# EAGLE design LED-Board (EAGLE 7.2.0)
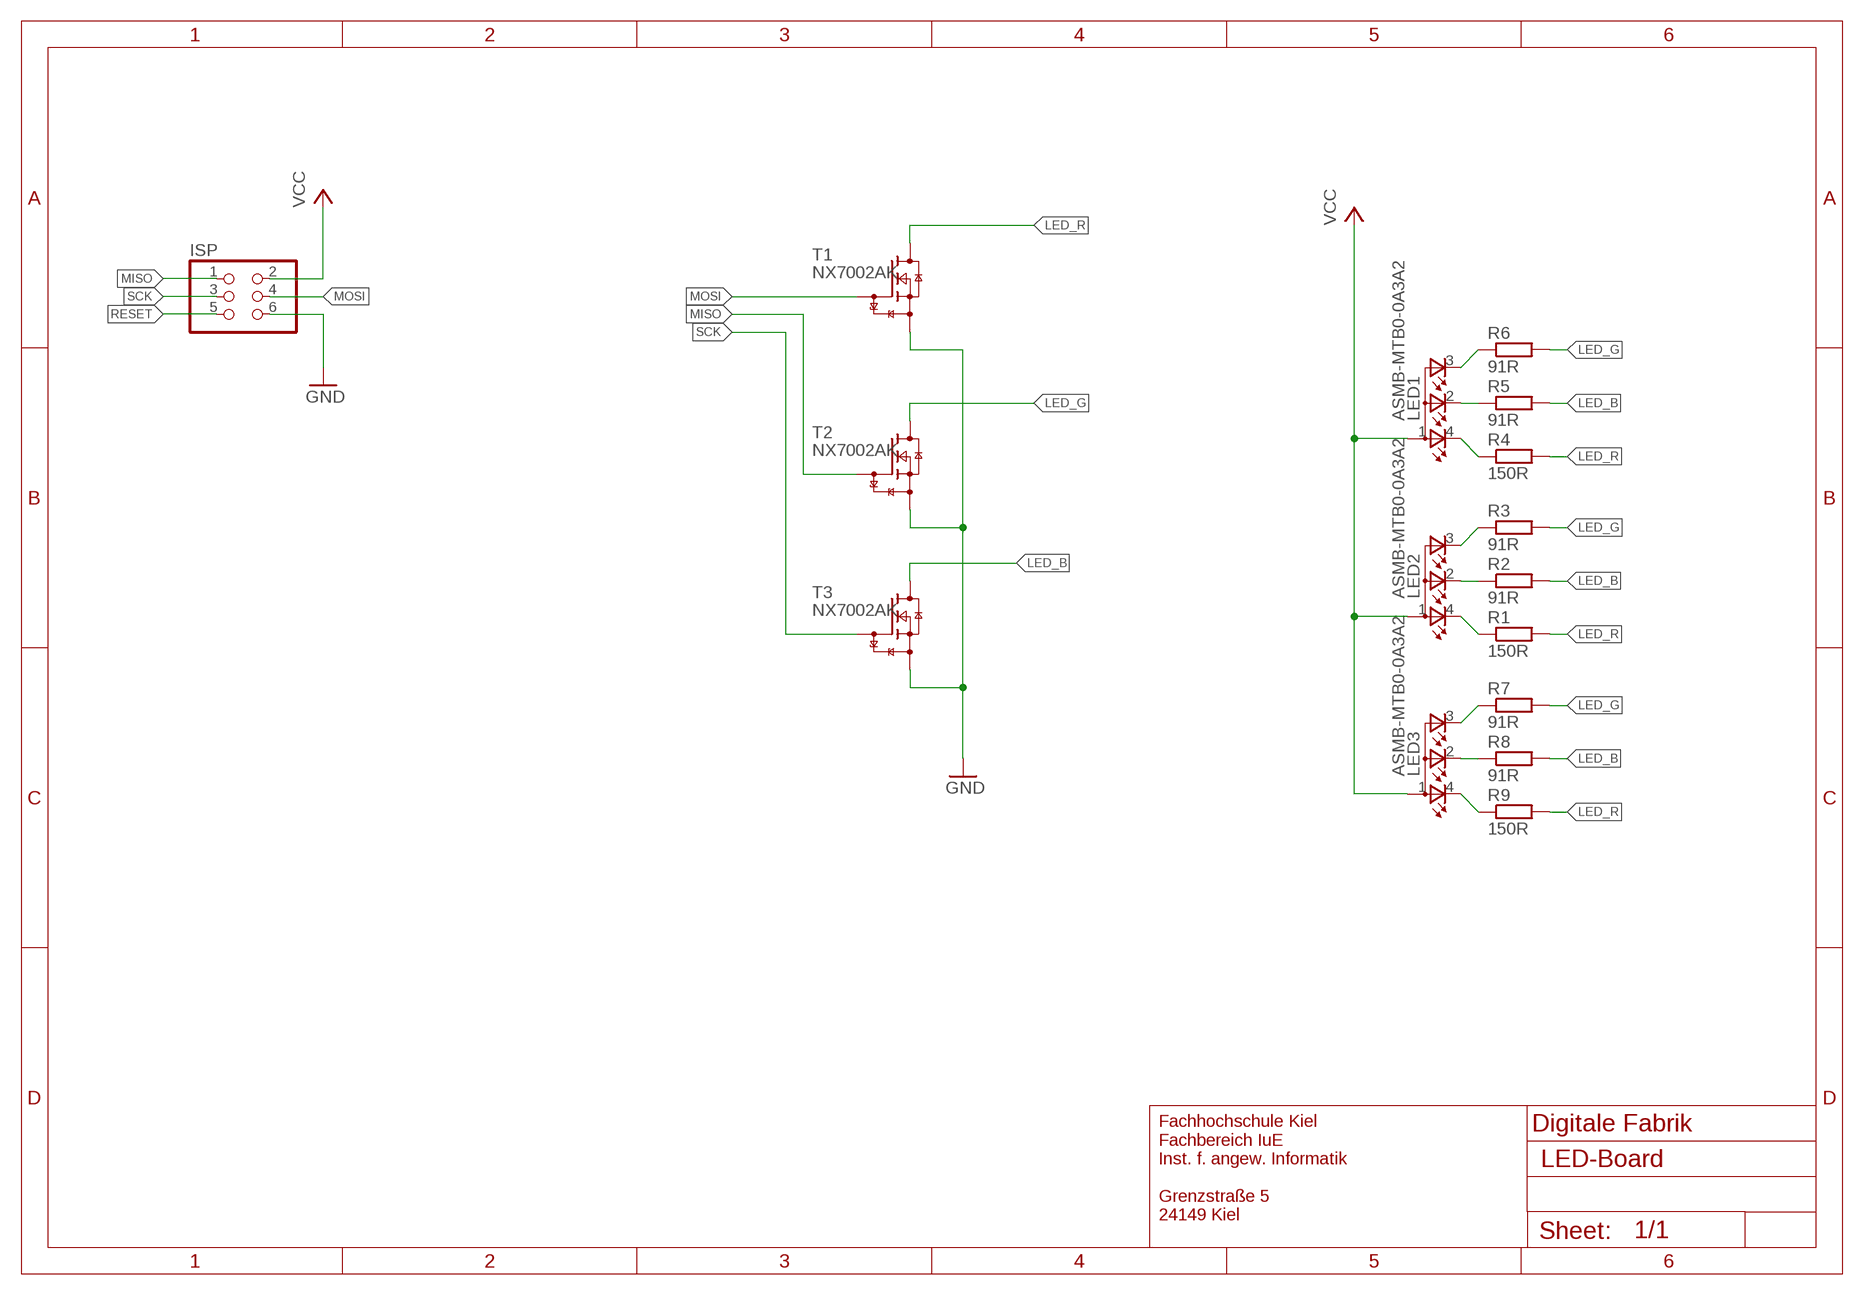
[diagram p0: schematic, sheet 1]

## Parts
ISP  PINHD-2X03_2.54-SMD  [2X03SMD]
LED1  ASMB-MTB0-0A3A2  PLCC4  [P-LCC-4-3]
LED2  ASMB-MTB0-0A3A2  PLCC4  [P-LCC-4-3]
LED3  ASMB-MTB0-0A3A2  PLCC4  [P-LCC-4-3]
R1  150R  R-EU_R0805  [R0805]
R2  91R  R-EU_R0805  [R0805]
R3  91R  R-EU_R0805  [R0805]
R4  150R  R-EU_R0805  [R0805]
R5  91R  R-EU_R0805  [R0805]
R6  91R  R-EU_R0805  [R0805]
R7  91R  R-EU_R0805  [R0805]
R8  91R  R-EU_R0805  [R0805]
R9  150R  R-EU_R0805  [R0805]
T1  NX7002AK  2N7002CK  [SOT23]
T2  NX7002AK  2N7002CK  [SOT23]
T3  NX7002AK  2N7002CK  [SOT23]

## Nets
GND: ISP.6 T1.2(S) T2.2(S) T3.2(S)
LED_B: R2.2 R5.2 R8.2 T3.3(D)
LED_G: R3.2 R6.2 R7.2 T2.3(D)
LED_R: R1.2 R4.2 R9.2 T1.3(D)
MISO: ISP.1 T2.1(G)
MOSI: ISP.4 T1.1(G)
N$1: LED1.4(CRED) R4.1
N$2: LED1.2(CBLUE) R5.1
N$3: LED1.3(CGREEN) R6.1
N$4: LED2.4(CRED) R1.1
N$5: LED2.2(CBLUE) R2.1
N$6: LED2.3(CGREEN) R3.1
N$7: LED3.3(CGREEN) R7.1
N$8: LED3.2(CBLUE) R8.1
N$9: LED3.4(CRED) R9.1
RESET: ISP.5
SCK: ISP.3 T3.1(G)
VCC: ISP.2 LED1.1(A2) LED2.1(A2) LED3.1(A2)

## Notes on the sheet
- Digitale Fabrik
- Fachhochschule Kiel
  Fachbereich IuE
  Inst. f. angew. Informatik
  
  Grenzstraße 5
  24149 Kiel

## Library data of the parts
ISP = pinhead-2:PINHD-2X03: PIN HEADER
LED1-LED3 = led:PLCC4: PLLC4 package Common Anode
R1-R9 = rcl:R-EU_: RESISTOR, European symbol
T1-T3 = nxp:2N7002CK: 60 V, 0.3 A N-channel Trench MOSFET ESD protected N-channel enhancement mode Field-Effect Transistor (FET) in a small SOT23 (TO-236AB) Surface-Mounted Device (SMD) plastic package using Trench MOSFET technology. AAL Eindhoven MK

## Board
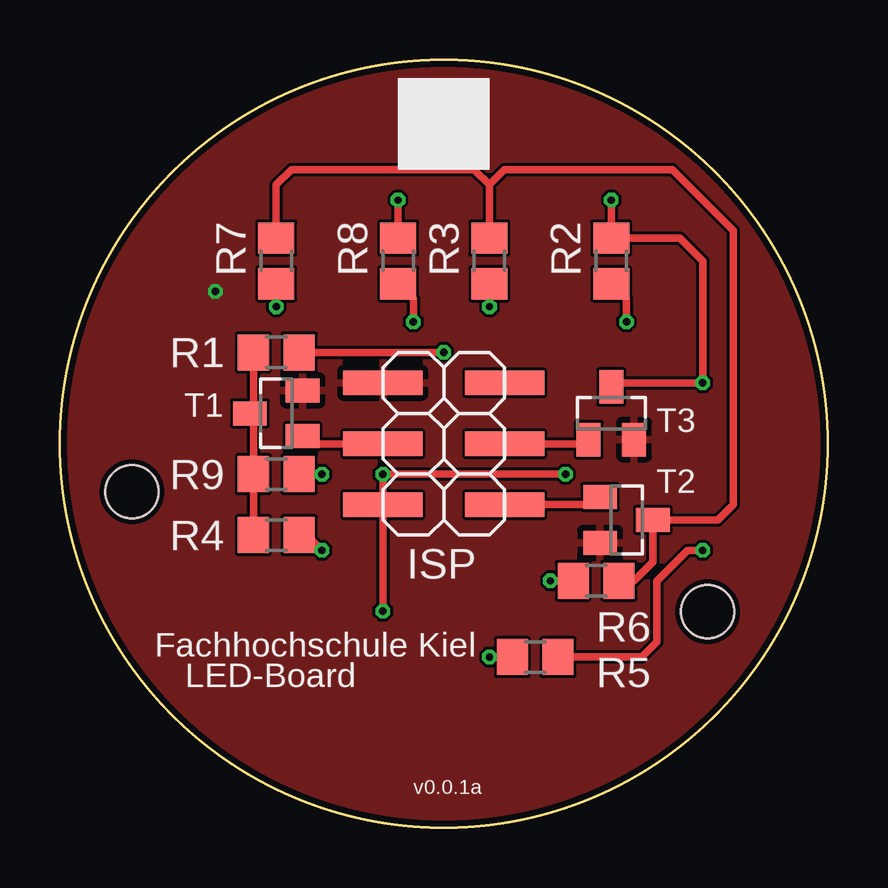
[diagram p1: board, top side]
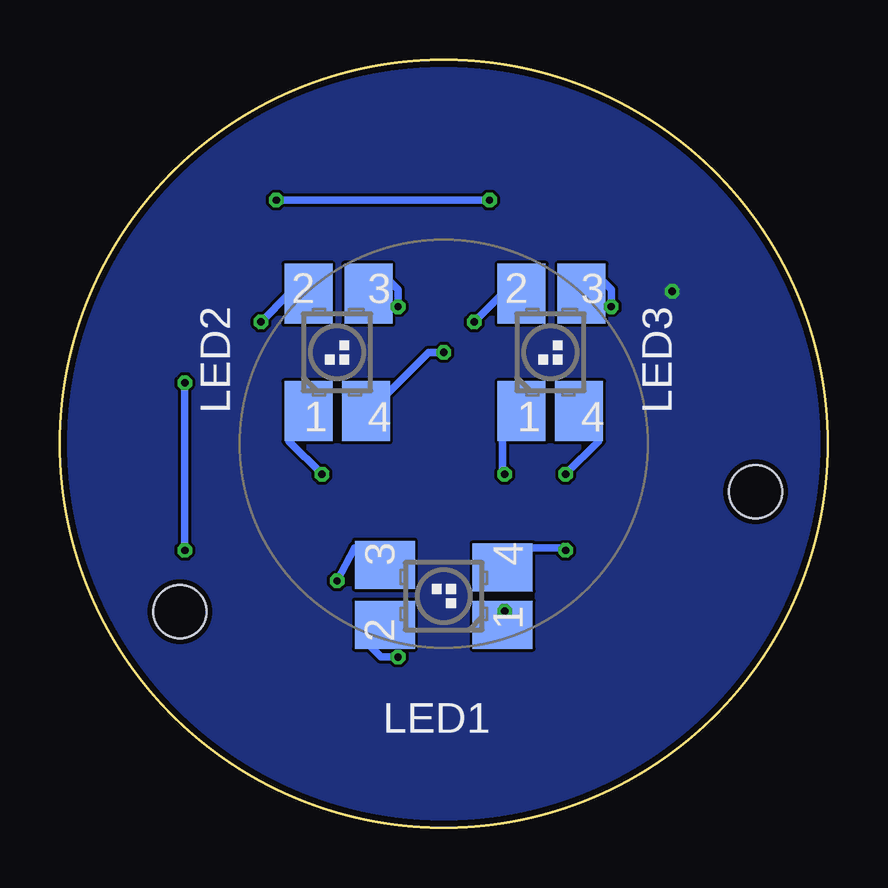
[diagram p2: board, bottom side, seen from below]

Size 32 x 32 mm. Coordinates in mm from the lower left corner, seen from the top.
Outline: circle at 16,16 radius 16
Copper layers (1*16): Top 0.035mm / dielectric 1.5mm / Bottom 0.035mm
Design rules "dirt_cheap_dirty_boards.v1": minimum track width 5mil, minimum drill 12mil, track to track 5mil, track to pad 5mil, pad to pad 5mil, via to via 5mil, smd to smd 0mil, copper to edge 10mil, drill to drill 10mil, minimum pad ring 10mil, minimum via ring 6mil, stop-mask expansion 2mil, vias tented up to drill 25mil, thermal gap 10mil
Holes 2.2 mm at 3,14 27,9

### Footprints (pad centres in the part's own frame; a part is rotated, then mirrored left to right if it is on the bottom)
2X03SMD = smd 1.016 x 3.302: 1 -1.27,-3.81; 2 -1.27,1.27; 3 1.27,-3.81; 4 1.27,1.27; 5 3.81,-3.81; 6 3.81,1.27
P-LCC-4-3 = smd 2 x 2.5: 1 -1.2,-2.45; 2 -1.2,2.45; 3 1.3,2.45; 4 1.2,-2.45
R0805 = smd 1.3 x 1.5: 1 -0.95,0; 2 0.95,0
SOT23 = smd 1 x 1.4: 1 -0.95,-1.1; 2 0.95,-1.1; 3 0,1.1

### Placement (x,y rotation side)
ISP  14.73,14.73 90 top
LED1  16,9.65 90 bottom
LED2  20.45,19.81 0 bottom
LED3  11.55,19.81 0 bottom
R1  9.02,19.81 180 top
R2  22.98,23.62 90 top
R3  17.91,23.62 90 top
R4  9.02,12.19 180 top
R5  19.81,7.11 0 top
R6  22.35,10.29 0 top
R7  9.02,23.62 90 top
R8  14.1,23.62 90 top
R9  9.02,14.73 180 top
T1  9.02,17.27 90 top
T2  23.62,12.82 270 top
T3  22.98,17.27 0 top

### Tracks (layer width: path | path; a pad name or v marks a point on that pad's centre or on a via)
GND  (via drill 0.3)
  other vias: 6.47,22.35
  pour Bottom: -0.51,0.12 -0.51,32.51 32.51,32.51 32.51,0.12
  pour Top: -0.51,0.12 -0.51,32.51 32.51,32.51 32.51,0.12
LED_B  (via drill 0.3)
  Top 0.305: R8.2 v14.1,26.16 | v22.98,26.16 R2.2 25.84,24.57 26.8,23.62 v26.8,18.54 23.16,18.54 T3.3 | R5.2 24.26,7.11 24.89,7.74 24.89,10.29 26.16,11.55 v26.8,11.55
  Bottom 0.305: v14.1,26.16 v22.98,26.16 | v26.8,11.55 v26.8,18.54
LED_G
  Top 0.305: R7.2 9.02,26.8 9.65,27.43 17.27,27.43 17.91,26.8 | R3.2 17.91,26.8 | 17.91,26.8 18.54,27.43 25.52,27.43 28.06,24.89 28.06,13.46 27.43,12.82 T2.3 24.72,11.07 23.93,10.29 R6.2
LED_R
  Top 0.305: R4.2 R9.2 8.07,17.12 T1.3 8.07,17.42 R1.2
MISO
  Top 0.305: ISP.1 22.2,13.46 T2.1
MOSI
  Top 0.305: ISP.4 10.43,16 T1.1
N$1  (via drill 0.3)
  Top 0.305: R4.1 10.29,12.19 v10.92,11.55
  Bottom 0.305: 12.85,11.65 11.02,11.65 v10.92,11.55
N$2  (via drill 0.3)
  Top 0.305: R5.1 v17.91,7.11
  Bottom 0.305: v17.91,7.11 18.61,7.11 19.15,7.65
N$3  (via drill 0.3)
  Top 0.305: v20.45,10.29 R6.1
  Bottom 0.305: 19.15,11.65 19.71,11.65 v20.45,10.29
N$4  (via drill 0.3)
  Top 0.305: v16,19.81 R1.1
  Bottom 0.305: 18.45,16.66 18.45,18 16.64,19.81 v16,19.81
N$5  (via drill 0.3)
  Top 0.305: v23.62,21.08 23.62,22.04 R2.1
  Bottom 0.305: 22.45,22.96 22.45,22.25 v23.62,21.08
N$6  (via drill 0.3)
  Top 0.305: R3.1 v17.91,21.71
  Bottom 0.305: v17.91,21.71 17.91,22.42 18.45,22.96
N$7  (via drill 0.3)
  Top 0.305: R7.1 v9.02,21.71
  Bottom 0.305: v9.02,21.71 9.02,22.42 9.55,22.96
N$8  (via drill 0.3)
  Top 0.305: v14.73,21.08 14.73,22.04 R8.1
  Bottom 0.305: 13.55,22.96 13.55,22.25 v14.73,21.08
N$9  (via drill 0.3)
  Top 0.305: v10.92,14.73 R9.1
  Bottom 0.305: 9.55,16.66 9.55,16.09 v10.92,14.73
SCK
  Top 0.305: ISP.3 21.87,16 T3.1
VCC  (via drill 0.3)
  Top 0.305: v13.46,9.02 ISP.2 v13.46,14.73 v21.08,14.73
  Bottom 0.305: 12.85,7.65 12.85,8.41 v13.46,9.02 | 13.55,16.66 13.55,14.82 v13.46,14.73 | 22.45,16.66 22.45,16.09 v21.08,14.73

### Text on the board
tNames: Fachhochschule Kiel | LED-Board | v0.0.1a